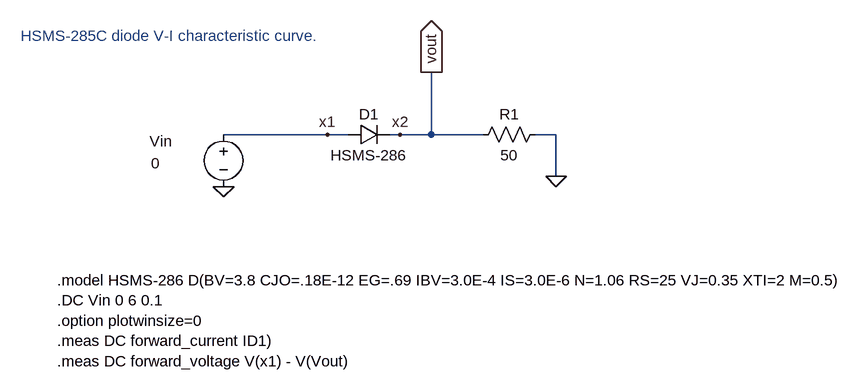
[diagram p0: schematic HMS_diode_test.asc]
HMS_diode_test.asc, the LTspice schematic file:
Version 4
SHEET 1 2300 680
WIRE 592 304 432 304
WIRE 624 304 592 304
WIRE 704 304 688 304
WIRE 752 304 752 208
WIRE 752 304 704 304
WIRE 832 304 752 304
WIRE 944 304 912 304
WIRE 944 368 944 304
FLAG 944 368 0
FLAG 752 208 vout
IOPIN 752 208 Out
FLAG 432 384 0
FLAG 592 304 x1
FLAG 704 304 x2
SYMBOL diode 624 320 R270
WINDOW 0 32 32 VTop 2
WINDOW 3 0 32 VBottom 2
SYMATTR InstName D1
SYMATTR Value HSMS-286
SYMBOL res 928 288 R90
WINDOW 0 0 56 VBottom 2
WINDOW 3 32 56 VTop 2
SYMATTR InstName R1
SYMATTR Value 50
SYMBOL voltage 432 288 R0
WINDOW 0 -114 26 Left 2
WINDOW 3 -111 60 Left 2
SYMATTR InstName Vin
SYMATTR Value 0
SYMATTR SpiceLine Rser=50
TEXT 176 528 Left 2 !.model HSMS-286 D(BV=3.8 CJO=.18E-12 EG=.69 IBV=3.0E-4 IS=3.0E-6 N=1.06 RS=25 VJ=0.35 XTI=2 M=0.5)\n.DC Vin 0 6 0.1\n.option plotwinsize=0\n.meas DC forward_current ID1)\n.meas DC forward_voltage V(x1) - V(Vout)
TEXT 120 152 Left 2 ;HSMS-285C diode V-I characteristic curve.

The netlist it stands for:
* HMS_diode_test.asc
D1 x1 x2 HSMS-286
R1 0 x2 50
Vin x1 0 0 Rser=50
.model D D
.lib standard.dio
.model HSMS-286 D(BV=3.8 CJO=.18E-12 EG=.69 IBV=3.0E-4 IS=3.0E-6 N=1.06 RS=25 VJ=0.35 XTI=2 M=0.5)
.DC Vin 0 6 0.1
.option plotwinsize=0
.meas DC forward_current ID1)
.meas DC forward_voltage V(x1) - V(Vout)
* HSMS-285C diode V-I characteristic curve.
.backanno
.end